# Altium project SAM9260-BSC-DK.PrjPcb (part 2 of 2)
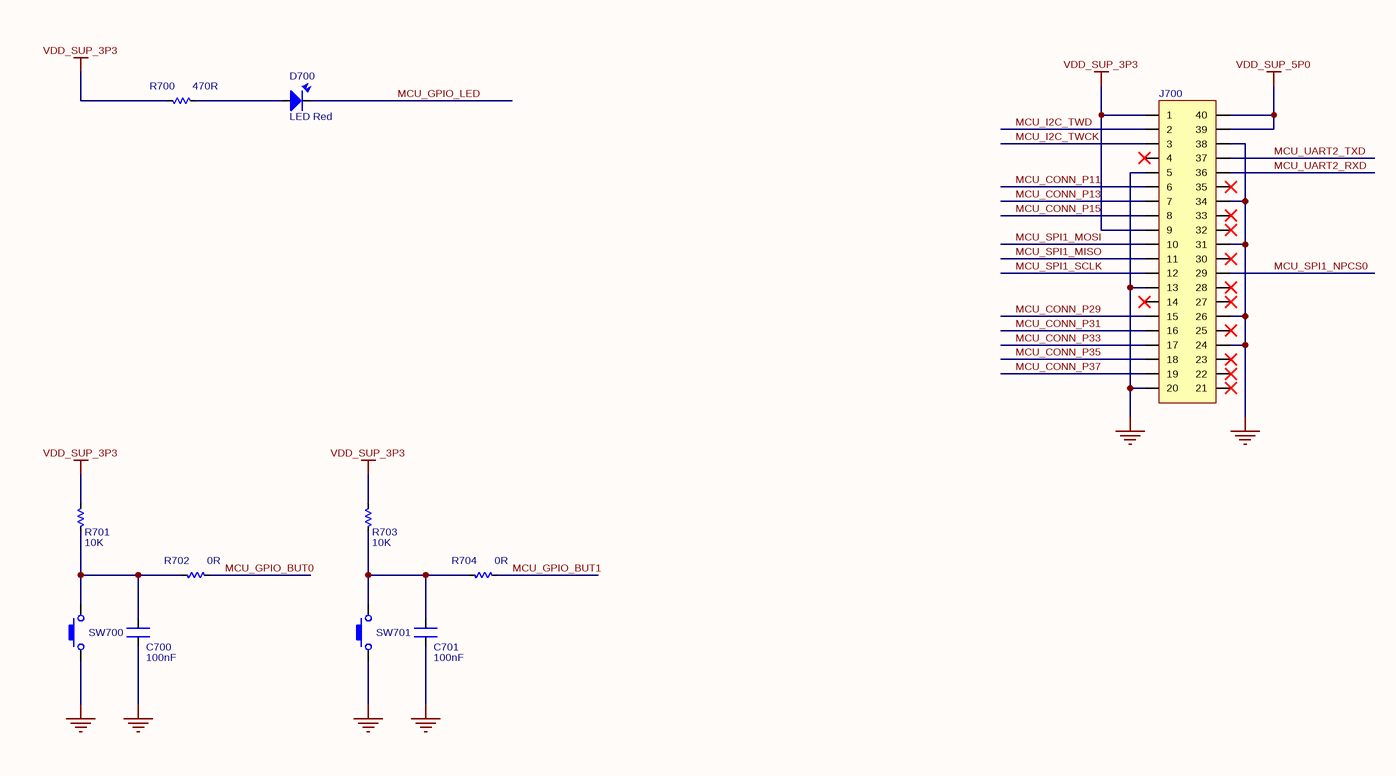
[diagram p7: 07-MISC.SchDoc]

## Nets that join several sheets
GND: 01-POWER (74 pins), 02-MCU (18 pins), 03-MEMORY (50 pins), 04-ETHERNET (22 pins), 05-SERIAL&USB (36 pins), 06-AUDIO (7 pins), 07-MISC (12 pins)
VDD_DBGU_3P3: 01-POWER (C143.2 C144.2 R111.1 U103.5), 05-SERIAL&USB (C508.2 R507.2 U500.6)
VDD_DBGU_5P0: 01-POWER (C142.2 U103.1 U103.3), 05-SERIAL&USB (6 pins)
VDD_SUP_3P3: 01-POWER (6 pins), 02-MCU (9 pins), 03-MEMORY (5 pins), 04-ETHERNET (L401.2), 05-SERIAL&USB (L506.2 L508.2), 06-AUDIO (L600.2), 07-MISC (5 pins)
VDD_SUP_5P0: 01-POWER (12 pins), 05-SERIAL&USB (L500.2), 07-MISC (J700.39 J700.40)
VDD_VDDCORE_1P8: 01-POWER (14 pins), 02-MCU (R201.1 R205.1)
VDD_VDDIO_3P3: 01-POWER (26 pins), 02-MCU (R204.1)
EBI_A2: 02-MCU (U1.97), 03-MEMORY (U300.23 U301.23)
EBI_A3: 02-MCU (U1.96), 03-MEMORY (U300.24 U301.24)
EBI_A4: 02-MCU (U1.95), 03-MEMORY (U300.25 U301.25)
EBI_A5: 02-MCU (U1.94), 03-MEMORY (U300.26 U301.26)
EBI_A6: 02-MCU (U1.93), 03-MEMORY (U300.29 U301.29)
EBI_A7: 02-MCU (U1.92), 03-MEMORY (U300.30 U301.30)
EBI_A8: 02-MCU (U1.89), 03-MEMORY (U300.31 U301.31)
EBI_A9: 02-MCU (U1.88), 03-MEMORY (U300.32 U301.32)
EBI_A10: 02-MCU (U1.87), 03-MEMORY (U300.33 U301.33)
EBI_A11: 02-MCU (U1.86), 03-MEMORY (U300.34 U301.34)
EBI_A13: 02-MCU (U1.84), 03-MEMORY (U300.35 U301.35)
EBI_A14: 02-MCU (U1.83), 03-MEMORY (U300.36 U301.36)
EBI_BA0: 02-MCU (U1.81), 03-MEMORY (U300.20 U301.20)
EBI_BA1: 02-MCU (U1.80), 03-MEMORY (U300.21 U301.21)
EBI_D0: 02-MCU (U1.106), 03-MEMORY (U300.2 U302.29)
EBI_D1: 02-MCU (U1.107), 03-MEMORY (U300.4 U302.30)
EBI_D2: 02-MCU (U1.108), 03-MEMORY (U300.5 U302.31)
EBI_D3: 02-MCU (U1.109), 03-MEMORY (U300.7 U302.32)
EBI_D4: 02-MCU (U1.110), 03-MEMORY (U300.8 U302.41)
EBI_D5: 02-MCU (U1.111), 03-MEMORY (U300.10 U302.42)
EBI_D6: 02-MCU (U1.112), 03-MEMORY (U300.11 U302.43)
EBI_D7: 02-MCU (U1.118), 03-MEMORY (U300.13 U302.44)
EBI_D8: 02-MCU (U1.119), 03-MEMORY (U300.42)
EBI_D9: 02-MCU (U1.120), 03-MEMORY (U300.44)
EBI_D10: 02-MCU (U1.121), 03-MEMORY (U300.45)
EBI_D11: 02-MCU (U1.122), 03-MEMORY (U300.47)
EBI_D12: 02-MCU (U1.123), 03-MEMORY (U300.48)
EBI_D13: 02-MCU (U1.124), 03-MEMORY (U300.50)
EBI_D14: 02-MCU (U1.125), 03-MEMORY (U300.51)
EBI_D15: 02-MCU (U1.126), 03-MEMORY (U300.53)
EBI_D16: 02-MCU (U1.128), 03-MEMORY (U301.2)
EBI_D17: 02-MCU (U1.129), 03-MEMORY (U301.4)
EBI_D18: 02-MCU (U1.130), 03-MEMORY (U301.5)
EBI_D19: 02-MCU (U1.131), 03-MEMORY (U301.7)
EBI_D20: 02-MCU (U1.134), 03-MEMORY (U301.8)
EBI_D21: 02-MCU (U1.135), 03-MEMORY (U301.10)
EBI_D22: 02-MCU (U1.136), 03-MEMORY (U301.11)
EBI_D23: 02-MCU (U1.137), 03-MEMORY (U301.13)
EBI_D24: 02-MCU (U1.138), 03-MEMORY (U301.42)
EBI_D25: 02-MCU (U1.139), 03-MEMORY (U301.44)
EBI_D26: 02-MCU (U1.140), 03-MEMORY (U301.45)
EBI_D27: 02-MCU (U1.141), 03-MEMORY (U301.47)
EBI_D28: 02-MCU (U1.142), 03-MEMORY (U301.48)
EBI_D29: 02-MCU (U1.143), 03-MEMORY (U301.50)
EBI_D30: 02-MCU (U1.144), 03-MEMORY (U301.51)
EBI_D31: 02-MCU (U1.145), 03-MEMORY (U301.53)
EBI_FIQ: 02-MCU (U1.56), 03-MEMORY (R306.2 R312.2)
EBI_NANDALE: 02-MCU (U1.74), 03-MEMORY (R308.2)
EBI_NANDCLE: 02-MCU (U1.73), 03-MEMORY (R307.2)
EBI_NANDCS: 02-MCU (U1.59), 03-MEMORY (R304.2 R311.2)
EBI_NANDOE: 02-MCU (U1.71), 03-MEMORY (R309.2)
EBI_NANDWE: 02-MCU (U1.72), 03-MEMORY (R310.2)
EBI_NBS0: 02-MCU (U1.99), 03-MEMORY (U300.15)
EBI_NBS1: 02-MCU (U1.102), 03-MEMORY (U300.39)
EBI_NBS2: 02-MCU (U1.98), 03-MEMORY (U301.15)
EBI_NBS3: 02-MCU (U1.101), 03-MEMORY (U301.39)
EBI_nCAS: 02-MCU (U1.104), 03-MEMORY (U300.17 U301.17)
EBI_nRAS: 02-MCU (U1.105), 03-MEMORY (U300.18 U301.18)
EBI_nSDWE: 02-MCU (U1.116), 03-MEMORY (U300.16 U301.16)
EBI_SDA10: 02-MCU (U1.100), 03-MEMORY (U300.22 U301.22)
EBI_SDCK: 02-MCU (U1.115), 03-MEMORY (U300.38 U301.38)
EBI_SDCKE: 02-MCU (U1.117), 03-MEMORY (U300.37 U301.37)
EBI_SDCS: 02-MCU (U1.103), 03-MEMORY (R300.2 R302.2)
MCU_CONN_P11: 02-MCU (U1.63), 07-MISC (J700.6)
MCU_CONN_P13: 02-MCU (U1.61), 07-MISC (J700.7)
MCU_CONN_P15: 02-MCU (U1.60), 07-MISC (J700.8)
MCU_CONN_P29: 02-MCU (U1.8), 07-MISC (J700.15)
MCU_CONN_P31: 02-MCU (U1.7), 07-MISC (J700.16)
MCU_CONN_P33: 02-MCU (U1.4), 07-MISC (J700.17)
MCU_CONN_P35: 02-MCU (U1.3), 07-MISC (J700.18)
MCU_CONN_P37: 02-MCU (U1.2), 07-MISC (J700.19)
MCU_DBGU_DRXD: 02-MCU (U1.21), 05-SERIAL&USB (U500.26)
MCU_DBGU_DTXD: 02-MCU (U1.22), 05-SERIAL&USB (U500.25)
MCU_EMAC_EMDC: 02-MCU (U1.205), 04-ETHERNET (R410.2)
MCU_EMAC_EMDINTR: 02-MCU (U1.186), 04-ETHERNET (R412.2)
MCU_EMAC_EMDIO: 02-MCU (U1.206), 04-ETHERNET (R411.2)
MCU_EMAC_ERX0: 02-MCU (U1.195), 04-ETHERNET (R407.2)
MCU_EMAC_ERX1: 02-MCU (U1.196), 04-ETHERNET (R406.2)
MCU_EMAC_ERXDV: 02-MCU (U1.198), 04-ETHERNET (R408.2)
MCU_EMAC_ERXER: 02-MCU (U1.201), 04-ETHERNET (R409.2)
MCU_EMAC_ETX0: 02-MCU (U1.193), 04-ETHERNET (R404.2)
MCU_EMAC_ETX1: 02-MCU (U1.194), 04-ETHERNET (R403.2)
MCU_EMAC_ETXCK: 02-MCU (U1.202), 04-ETHERNET (R401.2)
MCU_EMAC_ETXEN: 02-MCU (U1.197), 04-ETHERNET (R405.2)
MCU_GPIO_BUT0: 02-MCU (U1.177), 07-MISC (R702.2)
MCU_GPIO_BUT1: 02-MCU (U1.178), 07-MISC (R704.2)
MCU_GPIO_LED: 02-MCU (U1.185), 07-MISC (D700.2)
MCU_I2C_TWCK: 02-MCU (U1.1), 03-MEMORY (R321.2), 07-MISC (J700.3)
MCU_I2C_TWD: 02-MCU (U1.208), 03-MEMORY (R322.2), 07-MISC (J700.2)
MCU_MCC_CI: 02-MCU (U1.64), 03-MEMORY (J300.9 R336.2)
MCU_MCCK: 02-MCU (U1.189), 03-MEMORY (R328.1)
MCU_MCDB1: 02-MCU (U1.184), 03-MEMORY (R330.1)
MCU_MCDB2: 02-MCU (U1.183), 03-MEMORY (R325.1)
MCU_nRST: 02-MCU (R203.2 R208.2 U1.36), 03-MEMORY (R318.2), 04-ETHERNET (R414.2)
MCU_SPI0_MISO_MCDB0: 02-MCU (U1.179), 03-MEMORY (R314.2 R329.1)
MCU_SPI0_MOSI_MCCDB: 02-MCU (U1.180), 03-MEMORY (R315.2 R327.1)
MCU_SPI0_NPCS0_MCDB3: 02-MCU (U1.182), 03-MEMORY (R326.1)
MCU_SPI0_NPCS1: 02-MCU (U1.57), 03-MEMORY (R317.2)
MCU_SPI0_SPCK: 02-MCU (U1.181), 03-MEMORY (R316.2)
MCU_SPI1_MISO: 02-MCU (U1.9), 07-MISC (J700.11)
MCU_SPI1_MOSI: 02-MCU (U1.10), 06-AUDIO (R602.2), 07-MISC (J700.10)
MCU_SPI1_NPCS0: 02-MCU (U1.12), 07-MISC (J700.29)
MCU_SPI1_NPCS2: 02-MCU (U1.62), 06-AUDIO (R601.2)
MCU_SPI1_SCLK: 02-MCU (U1.11), 06-AUDIO (R603.2), 07-MISC (J700.12)
MCU_SSC_RD0: 02-MCU (U1.28), 06-AUDIO (R607.2)
MCU_SSC_RF0: 02-MCU (U1.164), 06-AUDIO (R608.2)
MCU_SSC_TD0: 02-MCU (U1.27), 06-AUDIO (R605.2)
MCU_SSC_TF0: 02-MCU (U1.26), 06-AUDIO (R606.2)
MCU_SSC_TK0: 02-MCU (U1.23), 06-AUDIO (R604.2)
MCU_UART2_RXD: 02-MCU (U1.20), 07-MISC (J700.36)
MCU_UART2_TXD: 02-MCU (U1.19), 07-MISC (J700.37)
MCU_USART0_CTS: 02-MCU (U1.172), 05-SERIAL&USB (R521.2)
MCU_USART0_DCD: 02-MCU (U1.166), 05-SERIAL&USB (R518.2)
MCU_USART0_DSR: 02-MCU (U1.165), 05-SERIAL&USB (R519.2)
MCU_USART0_DTR: 02-MCU (U1.167), 05-SERIAL&USB (R517.2)
MCU_USART0_RI: 02-MCU (U1.168), 05-SERIAL&USB (R522.2)
MCU_USART0_RTS: 02-MCU (U1.171), 05-SERIAL&USB (R515.2)
MCU_USART0_RXD: 02-MCU (U1.16), 05-SERIAL&USB (R520.2)
MCU_USART0_TXD: 02-MCU (U1.15), 05-SERIAL&USB (R516.2)
MCU_USART1_CTS: 02-MCU (U1.176), 05-SERIAL&USB (R512.2)
MCU_USART1_RTS: 02-MCU (U1.175), 05-SERIAL&USB (R510.2)
MCU_USART1_RXD: 02-MCU (U1.18), 05-SERIAL&USB (R511.2)
MCU_USART1_TXD: 02-MCU (U1.17), 05-SERIAL&USB (R509.2)
MCU_USBD_DDM: 02-MCU (U1.54), 05-SERIAL&USB (C506.2 R505.1)
MCU_USBD_DDP: 02-MCU (U1.55), 05-SERIAL&USB (C507.2 R506.1)
MCU_USBD_USBCNX: 02-MCU (U1.67), 05-SERIAL&USB (R503.1)
MCU_USBH_HDMA: 02-MCU (U1.50), 05-SERIAL&USB (R500.1)
MCU_USBH_HDPA: 02-MCU (U1.51), 05-SERIAL&USB (R501.1)